# EAGLE design Noduino-Quantum (EAGLE 6.6.0)
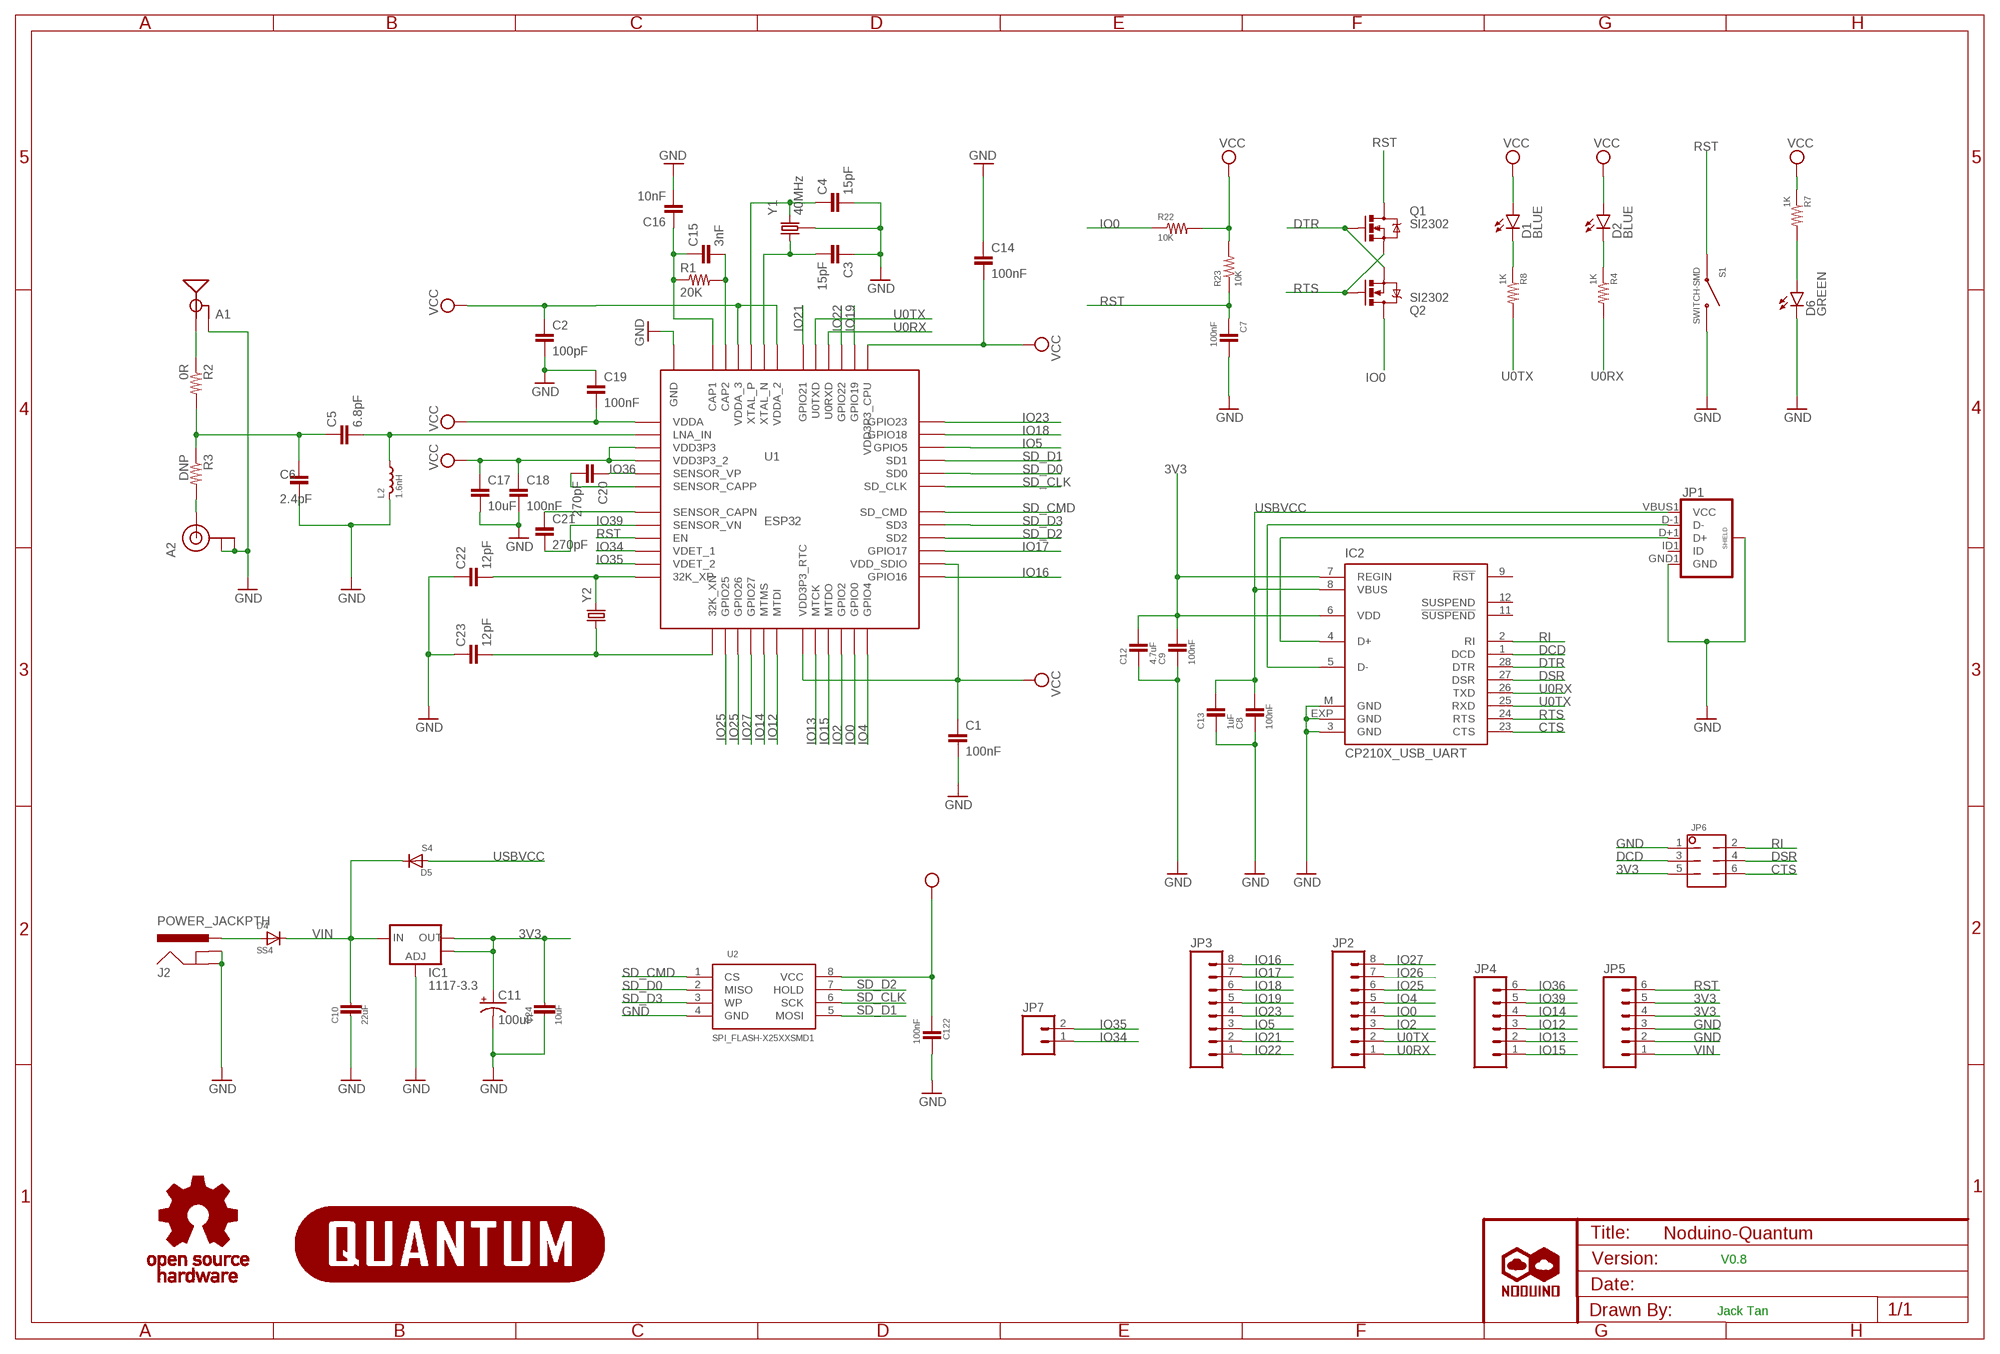
[diagram p0: schematic, sheet 1]

## Parts
A1  ANTENNATPLACE  [TRACE_ANTENNA_2.4GHZ_15.2MM_TPLACE]
A2  U.FL  [U.FL]
C1  100nF  0402-CAP  [0402-CAP]
C2  100pF  0402-CAP  [0402-CAP]
C3  15pF  0402-CAP  [0402-CAP]
C4  15pF  0402-CAP  [0402-CAP]
C5  6.8pF  0402-CAP  [0402-CAP]
C6  2.4pF  0402-CAP  [0402-CAP]
C7  100nF  0402-CAP  [0402-CAP]
C8  100nF  0603-CAP  [0603-CAP]
C9  100nF  0603-CAP  [0603-CAP]
C10  22uF  CAP-C1206  [C1206]
C11  100uF  CAP_POL3528  [EIA3528]
C12  4.7uF  0603-CAP  [0603-CAP]
C13  1uF  0603-CAP  [0603-CAP]
C14  100nF  0402-CAP  [0402-CAP]
C15  3nF  0402-CAP  [0402-CAP]
C16  10nF  0402-CAP  [0402-CAP]
C17  10uF  0603-CAP  [0603-CAP]
C18  100nF  0402-CAP  [0402-CAP]
C19  100nF  0402-CAP  [0402-CAP]
C20  270pF  0402-CAP  [0402-CAP]
C21  270pF  0402-CAP  [0402-CAP]
C22  12pF  0402-CAP  [0402-CAP]
C23  12pF  0402-CAP  [0402-CAP]
C24  10uF  CAP-C1206  [C1206]
C122  100nF  0402-CAP  [0402-CAP]
D1  BLUE  LED-GREEN0603  [LED-0603]
D2  BLUE  LED-GREEN0603  [LED-0603]
D4  SS4  DIODEHV  [DO214]
D5  S4  DIODESOD  [SOD-323]
D6  GREEN  LED-GREEN0603  [LED-0603]
IC1  1117-3.3  AMS1117SOT223  [SOT223]
IC2  CP210X_USB_UART  [MLP28]
J2  POWER_JACKPTH  [POWER_JACK_PTH]
JP1  USB_MICROB_PLUG  [MICROUSB-SMD-DIP]
JP2  M081X08  [1X08]
JP3  M081X08  [1X08]
JP4  M06SIP  [1X06]
JP5  M06SIP  [1X06]
JP6  M02X3  [2X3]
JP7  M02PTH  [1X02]
L2  1.6nH  INDUCTOR0402  [0402-IND]
Q1  SI2302  -MOSFET-N-SMD  [SOT23-3]
Q2  SI2302  -MOSFET-N-SMD  [SOT23-3]
R1  20K  0402-RESISTOR  [0402-RES]
R2  0R  0402-RESISTOR  [0402-RES]
R3  DNP  0402-RESISTOR  [0402-RES]
R4  1K  0603-RESISTOR  [0603-RES]
R7  1K  0603-RESISTOR  [0603-RES]
R8  1K  0603-RESISTOR  [0603-RES]
R22  10K  0603-RESISTOR  [0603-RES]
R23  10K  0402-RESISTOR  [0402-RES]
S1  SWITCH-SMD  [TACTILE-SWITCH-1101NE]
U1  ESP32  [QFN48-0.4MM]
U2  SPI_FLASH-X25XXSMD1  [SO08-EIAJ]
U$1  NODUINO-LOGO-ALL  [NODUINO-ALL-1]
U$2  NODUINO-QUANTUM-LOGO  [NODUINO-QUANTUM-LOGO]
U$3  OPEN_HARDWARE_LOGO  [OPEN_HARDWARE_LOGO]
Y1  40MHz  CRYSTAL-GROUNDED2520  [2520-CRY]
Y2  CRYSTALMS3V  [CRYSTAL-32KHZ-MS3V]

## Nets
3V3: C1.1 C2.1 C9.2 C11.A(+) C12.2 C14.2 C17.1 C18.1 C19.2 C24.1 C122.1 D1.A D2.A IC1.2(OUT) IC1.4(OUT) IC2.6(VDD) IC2.7(REGIN) JP5.4 JP5.5 JP6.5 R7.1 R22.2 R23.2 U1.1(VDDA) U1.3(VDD3P3) U1.4(VDD3P3_2) U1.19(VDD3P3_RTC) U1.26(VDD_SDIO) U1.37(VDD3P3_CPU) U1.43(VDDA_2) U1.46(VDDA_3) U2.8(VCC) ; supply symbol labelled VCC
CTS: IC2.23(CTS) JP6.6
DCD: IC2.1(DCD) JP6.3
DSR: IC2.27(DSR) JP6.4
DTR: IC2.28(DTR) Q1.1(G) Q2.2(S)
GND: A1.GND A2.P$1(GND) A2.P$2(GND) C1.2 C2.2 C3.1 C4.2 C6.2 C7.2 C8.1 C9.1 C10.2 C11.C(-) C12.1 C13.1 C14.1 C16.2 C17.2 C18.2 C19.1 C22.1 C23.1 C24.2 C122.2 D6.C IC1.1(ADJ) IC2.3(GND) IC2.EXP(GND) IC2.M(GND) J2.GND J2.GNDBREAK JP1.GND1(GND) JP1.P$1(SHIELD) JP1.P$2(SHIELD) JP1.P$3(SHIELD) JP1.P$4(SHIELD) JP5.2 JP5.3 JP6.1 L2.1(X1) S1.P$1 U1.EP(GND) U2.4(GND) Y1.2(GND) Y1.4(GND)
IO0: JP2.4 Q2.3(D) R22.1 U1.23(GPIO0)
IO2: JP2.3 U1.22(GPIO2)
IO4: JP2.5 U1.24(GPIO4)
IO5: JP3.3 U1.34(GPIO5)
IO12: JP4.3 U1.18(MTDI)
IO13: JP4.2 U1.20(MTCK)
IO14: JP4.4 U1.17(MTMS)
IO15: JP4.1 U1.21(MTDO)
IO16: JP3.8 U1.25(GPIO16)
IO17: JP3.7 U1.27(GPIO17)
IO18: JP3.6 U1.35(GPIO18)
IO19: JP3.5 U1.38(GPIO19)
IO21: JP3.2 U1.42(GPIO21)
IO22: JP3.1 U1.39(GPIO22)
IO23: JP3.4 U1.36(GPIO23)
IO25: JP2.6 U1.14(GPIO25)
IO26: JP2.7 U1.15(GPIO26)
IO27: JP2.8 U1.16(GPIO27)
IO34: JP7.1 U1.10(VDET_1)
IO35: JP7.2 U1.11(VDET_2)
IO36: C20.1 JP4.6 U1.5(SENSOR_VP)
IO39: C21.2 JP4.5 U1.8(SENSOR_VN)
LNA: C5.2 L2.2(X2) U1.2(LNA_IN)
N$1: D1.C R8.1
N$2: C4.1 U1.45(XTAL_P) Y1.3
N$3: C3.2 U1.44(XTAL_N) Y1.1
N$5: IC2.4(D+) JP1.D+1(D+)
N$7: A1.ANT(SIGNAL) R2.1
N$9: IC2.5(D-) JP1.D-1(D-)
N$11: C15.2 R1.2 U1.47(CAP2)
N$12: D2.C R4.1
N$13: D6.A R7.2
N$16: D4.A J2.PWR
N$17: C15.1 C16.1 R1.1 U1.48(CAP1)
N$18: A2.P$3(SIGNAL) R3.2
N$20: C5.1 C6.1 R3.1
N$24: C21.1 U1.7(SENSOR_CAPN)
N$26: C20.2 U1.6(SENSOR_CAPP)
N$30: C22.2 U1.12(32K_XP) Y2.P$2
N$31: C23.2 U1.13(32K_XN) Y2.P$1
RI: IC2.2(RI) JP6.2
RST: C7.1 JP5.6 Q1.3(D) R23.1 S1.P$2 U1.9(EN)
RTS: IC2.24(RTS) Q1.2(S) Q2.1(G)
SD_CLK: U1.31(SD_CLK) U2.6(SCK)
SD_CMD: U1.30(SD_CMD) U2.1(CS)
SD_D0: U1.32(SD0) U2.2(MISO)
SD_D1: U1.33(SD1) U2.5(MOSI)
SD_D2: U1.28(SD2) U2.7(HOLD)
SD_D3: U1.29(SD3) U2.3(WP)
U0RX: IC2.26(TXD) JP2.1 R4.2 U1.40(U0RXD)
U0TX: IC2.25(RXD) JP2.2 R8.2 U1.41(U0TXD)
USBVCC: C8.2 C13.2 D5.2(A) IC2.8(VBUS) JP1.VBUS1(VCC)
VIN: C10.1 D4.C D5.1(C) IC1.3(IN) JP5.1
Unconnected: IC2.9(!RST) IC2.11(!SUSPEND) IC2.12(SUSPEND) JP1.ID1(ID) R2.2

## Notes on the sheet
- V0.8
- Jack Tan

## Library data of the parts
A1 = ehl:ANTENNA: Chip antenna Chip antenna with ground or secondary connection. Common with larger metal RF connectors.
A2 = SparkFun_ESP8266_Thing:U.FL: SMD antenna connector- WRL-09144; PROD_ID: CONN-09193
C1-C7 C14-C16 C18-C23 C122 = ehl:0402-CAP
C8 C9 C12 C13 C17 = ehl:0603-CAP
C10 C24 = digital-toy:CAP: Capacitor Standard 0603 ceramic capacitor, and 0.1" leaded capacitor.
C11 = ehl:CAP_POL: Capacitor Polarized These are standard SMD and PTH capacitors. Normally 10uF, 47uF, and 100uF in electrolytic and tantalum varieties. Always verify the external diameter of the through hole cap, it varies with capacity, voltage, and manufacturer. The EIA devices should be standard.
D1 D2 = SparkFun_ESP8266_Thing:LED-GREEN: Various green LEDs Green LEDs used in SFE Production 0603- DIO-00821 LARGE- DIO-00862 LILYPAD- DIO-09910; PROD_ID: DIO-00821; VALUE: GREEN
D4 D5 = ehl:DIODE: Diode These are standard reverse protection diodes and small signal diodes. SMA package can handle up to about 1A. SOD-323 can handle about 200mA. What the SOD-323 package when ordering, there are some mfgs out there that are 5-pin packages.
D6 = SparkFun_ESP8266_Thing:LED-GREEN: Various green LEDs Green LEDs used in SFE Production 0603- DIO-00821 LARGE- DIO-00862 LILYPAD- DIO-09910; PROD_ID: DIO-00821
IC1 = ehl:AMS1117: Voltage Regulator LM1117 Standard adjustable voltage regulator but in SMD form. Spark Fun Electronics SKU : COM-00595
IC2 = ehl:CP210X_USB_UART: Single-Chip USB to UART Bridge Source: www.silabs.com .. CP2101.pdf / cp2102.pdf. Spark Fun Electronics SKU : COM-00310
J2 = ehl:POWER_JACK: Power Jack This is the standard 5.5mm barrel jack for power. The PTH is the most common, proven, reliable, footprint. All others are experimental. The Slot footprint only works if the mill layer is transmitted to the PCB fab house so be warned. Spark Fun Electronics SKU : PRT-00119. Mating wall wart : TOL-00298 (and others)
JP1 = ehl:USB_MICROB_PLUG: USB Micro-B connectors Some male, some female. Watch your step!
JP2 JP3 = ehl:M08: Header 8 Standard 8-pin 0.1" header. Use with straight break away headers (SKU : PRT-00116), right angle break away headers (PRT-00553), swiss pins (PRT-00743), machine pins (PRT-00117), and female headers (PRT-00115).
JP4 JP5 = ehl:M06: Header 6 Standard 6-pin 0.1" header. Use with straight break away headers (SKU : PRT-00116), right angle break away headers (PRT-00553), swiss pins (PRT-00743), machine pins (PRT-00117), and female headers (PRT-00115). Molex polarized connector foot print use with SKU : PRT-08094 with associated crimp pins and housings. NOTES ON THE VARIANTS LOCK and LOCK_LONGPADS... This footprint was designed to help hold the alignment of a through-hole component (i.e. 6-pin header) while soldering it into place. You may notice that each hole has been shifted either up or down by 0.005 of an inch from it's more standard position (which is a perfectly straight line). This slight alteration caused the pins (the squares in the middle) to touch the edges of the holes. Because they are alternating, it causes a "brace" to hold the component in place. 0.005 has proven to be the perfect amount of "off-center" position when using our standard breakaway headers. Although looks a little odd when you look at the bare footprint, once you have a header in there, the alteration is very hard to notice. Also, if you push a header all the way into place, it is covered up entirely on the bottom side. This idea of altering the position of holes to aid alignment will be further integrated into the Sparkfun Library for other footprints. It can help hold any component with 3 or more connection pins.
JP6 = ehl:M02X3
JP7 = ehl:M02: Header 2 Standard 2-pin 0.1" header. Use with straight break away headers (SKU : PRT-00116), right angle break away headers (PRT-00553), swiss pins (PRT-00743), machine pins (PRT-00117), and female headers (PRT-00115). Molex polarized connector foot print use with SKU : PRT-08233 with associated crimp pins and housings.
L2 = ehl:INDUCTOR
Q1 Q2 = digital-toy:*-MOSFET-N
R1-R3 R23 = ehl:0402-RESISTOR
R4 R7 R8 R22 = ehl:0603-RESISTOR
S1 = ehl:SWITCH-SMD
U1 = ehl:ESP32
U2 = ehl:SPI_FLASH-X25XX: 8pin SPI Flash series x25xx. Works with devices like W25X32 and BR25L32
U$1 = ehl:NODUINO-LOGO-ALL
U$2 = ehl:NODUINO-QUANTUM-LOGO
U$3 = ehl:OPEN_HARDWARE_LOGO
Y1 = ehl:CRYSTAL-GROUNDED
Y2 = ehl:CRYSTAL: Crystals Various standard crystals. Proven footprints. Spark Fun Electronics SKU : COM-00534

## Board
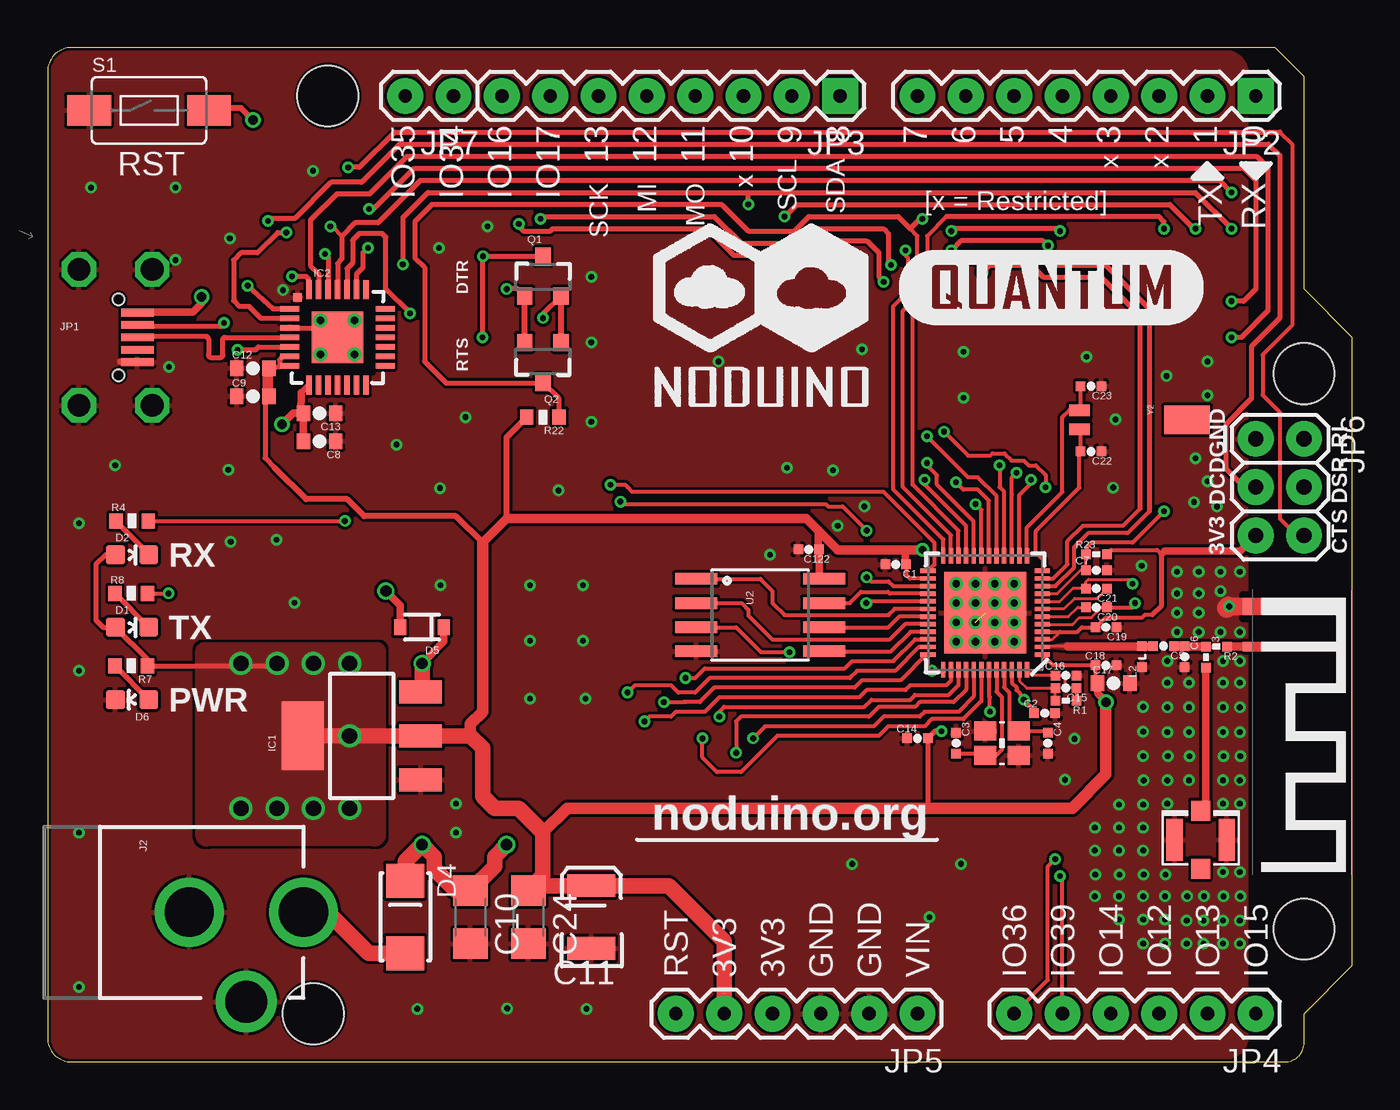
[diagram p1: board, top side]
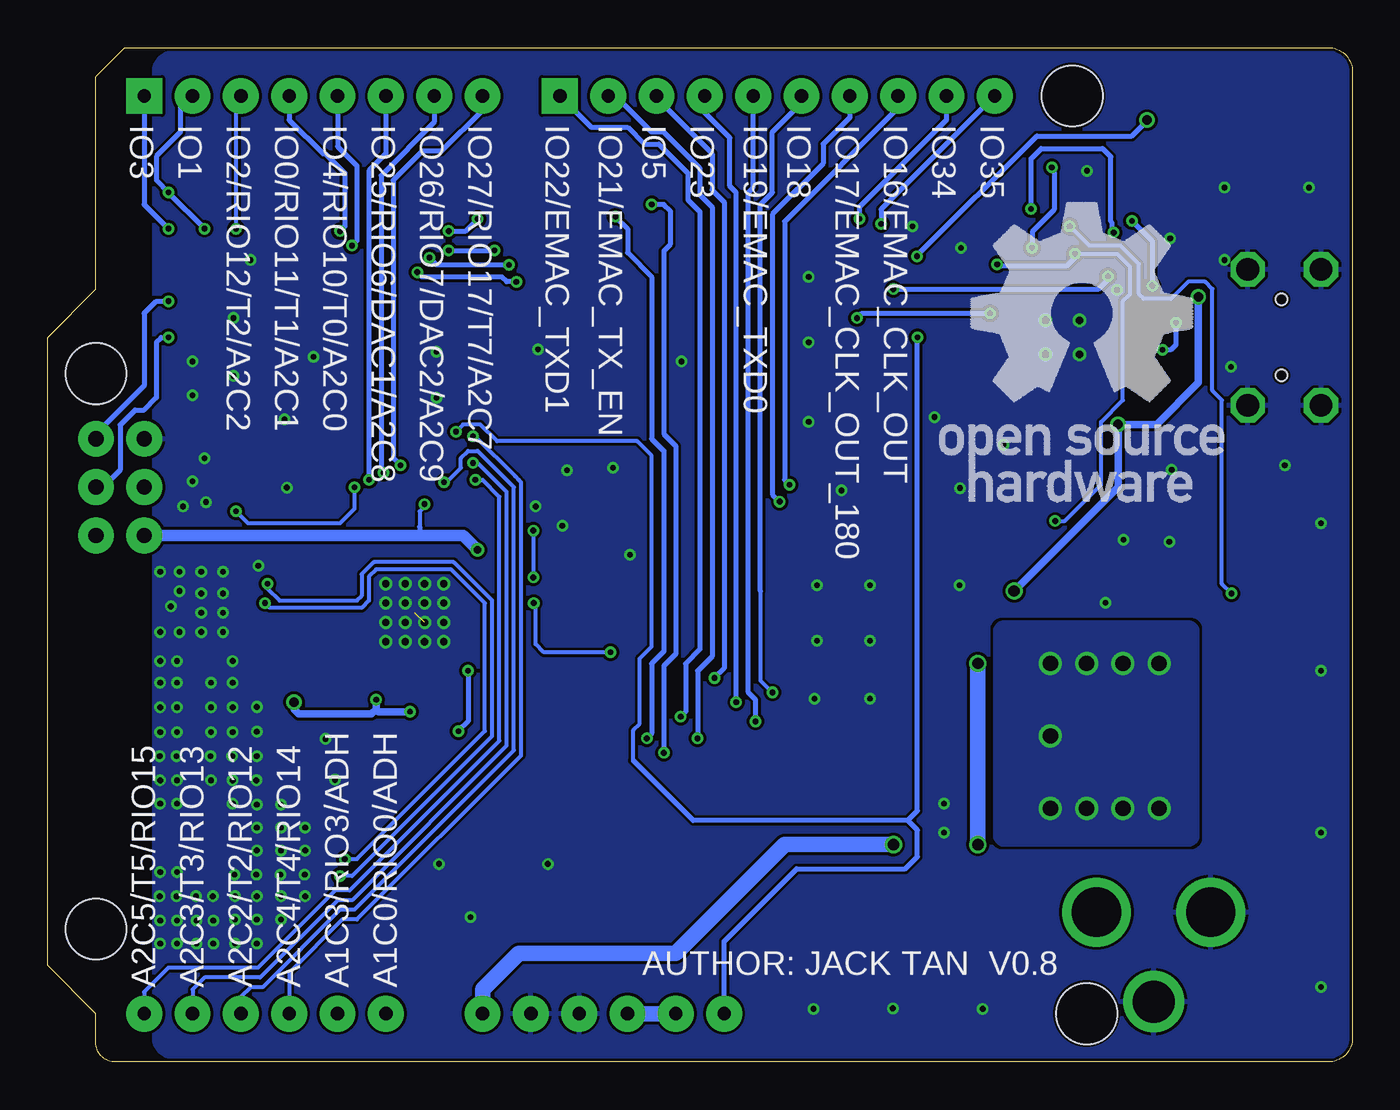
[diagram p2: board, bottom side, seen from below]

Size 68.58 x 53.34 mm. Coordinates in mm from the lower left corner, seen from the top.
Outline: 1.27,0 65.02,0 arc90 66.04,1.02 66.04,2.54 68.58,5.08 68.58,38.1 66.04,40.64 66.04,51.82 64.52,53.34 1.27,53.34 arc90 0,52.07 0,1.27 arc90 1.27,0
Copper layers (1*16): Top 0.035mm / dielectric 1.5mm / Bottom 0.035mm
Design rules "jackslab-micromod": minimum track width 6mil, minimum drill 0.3mm, track to track 6mil, track to pad 6mil, pad to pad 6mil, via to via 6mil, smd to smd 6mil, copper to edge 6mil, drill to drill 6mil, minimum pad ring 6mil, minimum via ring 6mil, stop-mask expansion 4mil, vias tented up to drill 20mil, thermal gap 6mil
Holes 3.2 mm at 66.04,6.99 66.04,36.2 14.73,50.8 13.97,2.54

### Footprints (pad centres in the part's own frame; a part is rotated, then mirrored left to right if it is on the bottom)
TRACE_ANTENNA_2.4GHZ_15.2MM_TPLACE = smd 0.5 x 0.5: ANT 0,-0.25 | smd 0.9 x 0.5: GND -2.1,-0.25
U.FL = smd 2.2 x 0.85: P$1 0,1.375; P$2 0,-1.375 | smd 1.05 x 1: P$3 1.525,0; P$4 -1.525,0
0402-CAP = smd 0.5 x 0.5: 1 -0.55,0; 2 0.55,0
0603-CAP = smd 0.7 x 0.8: 1 -0.85,0; 2 0.85,0
C1206 = smd 1.6 x 1.8: 1 -1.4,0; 2 1.4,0
EIA3528 = smd 1.2 x 2.5: A 1.65,0; C -1.65,0
LED-0603 = smd 1 x 1: A 0,-0.877; C 0,0.877
DO214 = smd 1.8 x 2: A 1.9,0; C -1.9,0
SOD-323 = smd 0.63 x 0.83: 1 -1.15,0; 2 1.15,0
SOT223 = smd 1.219 x 2.235: 1 -2.311,-3.099; 2 0,-3.099; 3 2.311,-3.099 | smd 3.6 x 2.2: 4 0,3.099
MLP28 = smd 1 x 0.3: 1 -2.5,1.5; 2 -2.5,1; 3 -2.5,0.5; 4 -2.5,0; 5 -2.5,-0.5; 6 -2.5,-1; 7 -2.5,-1.5; 15 2.5,-1.5; 16 2.5,-1; 17 2.5,-0.5; 18 2.5,0; 19 2.5,0.5; 20 2.5,1; 21 2.5,1.5 | smd 0.3 x 1: 8 -1.5,-2.5; 9 -1,-2.5; 10 -0.5,-2.5; 11 0,-2.5; 12 0.5,-2.5; 13 1,-2.5; 14 1.5,-2.5; 22 1.5,2.5; 23 1,2.5; 24 0.5,2.5; 25 0,2.5; 26 -0.5,2.5; 27 -1,2.5; 28 -1.5,2.5 | smd 2.7 x 2.7: EXP 0,0 | smd 0.435 x 0.435: M -2.103,2.103
POWER_JACK_PTH = drill 2.6: GND 0,7.7; PWR 0,13.7 | drill 2.2: GNDBREAK 4.7,10.7
MICROUSB-SMD-DIP = smd 1.7 x 0.4: D+1 3.2,0; D-1 3.2,0.65; GND1 3.2,-1.3; ID1 3.2,-0.65; VBUS1 3.2,1.3 | drill 1.2 octagon: P$1 0.125,-3.575; P$2 0.125,3.575; P$3 3.975,-3.575; P$4 3.975,3.575 | hole 0.6: 2.2,2; 2.2,-2
1X08 = drill 0.7 pad 1.88 square: 1 0,0 | drill 0.7 pad 1.88: 2 2.54,0; 3 5.08,0; 4 7.62,0; 5 10.16,0; 6 12.7,0; 7 15.24,0; 8 17.78,0
1X06 = drill 0.7 pad 1.88: 1 0,0; 2 2.54,0; 3 5.08,0; 4 7.62,0; 5 10.16,0; 6 12.7,0
2X3 = drill 0.8 pad 1.88: 1 0,0; 2 0,2.54; 3 2.54,0; 4 2.54,2.54; 5 5.08,0; 6 5.08,2.54
1X02 = drill 0.7 pad 1.88: 1 0,0; 2 2.54,0
0402-IND = smd 0.5 x 0.5: 1 -0.55,0; 2 0.55,0
SOT23-3 = smd 0.8 x 0.9: 1 -0.95,-1; 2 0.95,-1; 3 0,1.1
0402-RES = smd 0.5 x 0.5: 1 -0.55,0; 2 0.55,0
0603-RES = smd 0.7 x 0.8: 1 -0.85,0; 2 0.85,0
TACTILE-SWITCH-1101NE = smd 2.3 x 1.6: P$1 -3.15,0; P$2 3.15,0
QFN48-0.4MM = smd 0.8 x 0.23: 1 -3,2.2; 2 -3,1.8; 3 -3,1.4; 4 -3,1; 5 -3,0.6; 6 -3,0.2; 7 -3,-0.2; 8 -3,-0.6; 9 -3,-1; 10 -3,-1.4; 11 -3,-1.8; 12 -3,-2.2; 25 3,-2.2; 26 3,-1.8; 27 3,-1.4; 28 3,-1; 29 3,-0.6; 30 3,-0.2; 31 3,0.2; 32 3,0.6; 33 3,1; 34 3,1.4; 35 3,1.8; 36 3,2.2 | smd 0.23 x 0.8: 13 -2.2,-3; 14 -1.8,-3; 15 -1.4,-3; 16 -1,-3; 17 -0.6,-3; 18 -0.2,-3; 19 0.2,-3; 20 0.6,-3; 21 1,-3; 22 1.4,-3; 23 1.8,-3; 24 2.2,-3; 37 2.2,3; 38 1.8,3; 39 1.4,3; 40 1,3; 41 0.6,3; 42 0.2,3; 43 -0.2,3; 44 -0.6,3; 45 -1,3; 46 -1.4,3; 47 -1.8,3; 48 -2.2,3 | smd 4.3 x 4.3: EP 0,0
SO08-EIAJ = smd 0.61 x 2.21: 1 -1.905,-3.378; 2 -0.635,-3.378; 3 0.635,-3.378; 4 1.905,-3.378; 5 1.905,3.353; 6 0.635,3.353; 7 -0.635,3.353; 8 -1.905,3.353
2520-CRY = smd 1.15 x 1: 1 -0.875,-0.65; 2 0.875,-0.65; 3 0.875,0.65; 4 -0.875,0.65
CRYSTAL-32KHZ-MS3V = smd 0.6 x 1.1: P$1 -0.5,-2; P$2 0.5,-2 | smd 1.5 x 2.4: P$3 0,3.65

### Placement (x,y rotation side)
A1  63.32,21.84 270 top
A2  60.6,11.68 90 top
C1  44.58,26.16 180 top
C2  52.4,18.34 0 top
C3  47.75,16.76 270 top
C4  52.58,16.76 270 top
C5  58.65,21.87 180 top
C6  59.77,21.31 270 top
C7  55.12,25.86 0 top
C8  14.3,32.64 180 top
C9  10.79,35 0 top
C10  22.23,7.62 270 top
C11  28.57,7.62 90 top
C12  10.79,36.47 0 top
C13  14.3,34.11 180 top
C14  45.72,17.02 0 top
C15  53.52,19.66 180 top
C16  53.52,20.32 0 top
C17  56.03,19.91 0 top
C18  55.63,20.85 0 top
C19  55.63,22.86 180 top
C20  55.12,23.9 180 top
C21  55.12,24.89 180 top
C22  54.84,32.11 180 top
C23  54.84,35.53 180 top
C24  25.27,7.62 270 top
C122  40.01,26.95 180 top
D1  4.45,22.86 270 top
D2  4.45,26.67 270 top
D4  18.8,7.62 270 top
D5  19.68,22.86 180 top
D6  4.45,19.05 90 top
IC1  16.51,17.14 90 top
IC2  15.24,38.1 0 top
J2  -0.25,7.87 270 top
JP1  1.52,38.1 0 top
JP2  63.5,50.8 180 top
JP3  41.66,50.8 180 top
JP4  63.5,2.54 180 top
JP5  45.72,2.54 180 top
JP6  63.5,32.77 270 top
JP7  21.34,50.8 180 top
L2  57.53,21.31 90 top
Q1  26.04,41.27 0 top
Q2  26.04,36.83 180 top
R1  53.52,19 180 top
R2  61.44,21.84 180 top
R3  60.88,21.29 270 top
R4  4.45,28.45 0 top
R7  4.39,20.83 180 top
R8  4.39,24.64 0 top
R22  26.04,33.91 180 top
R23  55.12,26.7 0 top
S1  5.33,50.04 0 top
U1  49.28,23.62 180 top
U2  37.47,23.5 270 top
U$1  31.5,33.78 0 top
U$2  44.76,38.77 0 top
U$3  21.71,29.44 0 bottom
Y1  50.16,16.76 0 top
Y2  56.24,33.76 270 top

### Tracks (layer width: path | path; a pad name or v marks a point on that pad's centre or on a via)
3V3  (via drill 0.3, 0.4, 0.5, 0.81)
  Top 0.152: U1.3 52.81,22.22 53.21,22.62
  Top 0.203: U1.43 49.48,19.23 49.53,19.18 v49.53,18.41 | U1.46 50.68,19.94 50.93,19.68 50.93,19.56 51.31,19.18 v51.31,19.05 51.85,18.51 C2.1 | U1.37 47.08,20.53 | U1.1 52.84,20.85 C18.1 55.08,20 55.16,19.91 C17.1 | U1.19 49.08,29.03 v48.77,29.34 | 58.06,23.52 57.68,23.52 57.53,23.37 55.63,23.37 55.08,22.82 C19.2 54.36,22.86 54.12,22.62 53.21,22.62 U1.4 | 58.55,26.7 58.32,26.92 55.9,26.92 R23.2 | U1.26 45.32,25.42 45.13,25.61 C1.1
  Top 0.254: 12.19,36.6 IC2.7 | IC2.6 12.37,37.11 12.19,36.93 12.19,36.6 | C9.2 11.43,35.48 | 11.43,35.48 11.43,36.2 | C12.2 12.19,36.58 12.19,36.6 | 58.06,23.52 58.55,24 58.55,26.7 | 11.43,35.48 11.43,31.75 11.94,31.24 | v12.06,20.95 11.94,20.83 R7.1 5.24,21.18 D1.A 2.92,22.86 2.54,23.24 2.54,26.16 3.05,26.67 D2.A | 47.08,20.53 46.52,20.53 v46.48,20.57 | 46.23,13.34 46.27,13.38 C14.2 46.65,17.4 v46.99,17.4
  Top 0.305: IC1.4 13.41,17.22 13.97,17.78 13.34,17.78 13.34,18.41 | 58.55,26.7 58.73,26.87 | 22.86,27.3 21.46,28.7 16.64,28.7 15.75,29.59 13.59,29.59 11.94,31.24 | 24.13,28.57 24.13,32.85 R22.2
  Top 0.406: JP6.5 62.69,26.87 58.73,26.87 | C9.2 C12.2 | C17.1 55.18,19.37 v55.63,18.92 | 40.51,26.99 C122.1 40.55,26.42 | 40.55,26.42 40.55,25.66 U2.8 | 40.51,27.94 40.51,26.46 40.55,26.42 | 45.09,26.92 45.09,26.2 C1.1
  Top 0.508: 22.86,27.3 24.13,28.57 39.88,28.57 40.51,27.94 41.53,26.92 45.09,26.92 v45.97,26.92
  Top 0.61: 26.04,12.06 27.3,13.34 46.23,13.34 53.85,13.34 55.63,15.11 v55.63,18.92 | 22.23,17.14 22.23,17.78 22.86,18.41 22.86,27.3
  Top 0.813: JP5.5 35.56,6.35 32.64,9.27 C11.A 25.52,9.27 C24.1 26.04,9.78 26.04,12.06 24.77,13.34 23.5,13.34 22.86,13.97 22.86,16.51 22.23,17.14 IC1.2 IC1.4
  Bottom 0.203: v48.77,29.34 48.77,29.21 49.02,28.96 49.02,28.14
  Bottom 0.254: 49.02,28.14 49.02,27.69 | v46.48,20.57 46.48,17.91 v46.99,17.4
  Bottom 0.406: v55.63,18.92 55.63,18.54 55.37,18.29 51.56,18.29 51.31,18.54 | 51.31,18.54 v51.31,19.05 | v49.53,18.41 51.18,18.41 51.31,18.54
  Bottom 0.61: JP6.5 49.02,27.69 46.74,27.69 v45.97,26.92
  Bottom 0.813: JP5.5 JP5.4
  other vias: 13.97,20.95 15.88,20.95 10.16,13.34 12.06,13.34 13.97,13.34 15.88,13.34 15.88,17.14 10.16,20.95
  pour Bottom (no thermals): 8.13,12.7 8.13,22.61 arc-90 8.64,23.11 17.53,23.11 18.03,23.11 18.29,23.11 arc-90 18.8,22.61 18.8,18.29 18.8,12.19 18.8,11.94 arc-90 18.29,11.43 8.64,11.43 arc-90 8.13,11.94
  pour Top (no thermals): 7.87,12.7 7.87,21.59 arc-90 8.26,21.97 17.14,21.97 17.3,21.97 arc-90 17.68,21.59 17.68,18.82 17.68,15.39 17.68,14.43 17.68,12.83 17.68,11.96 arc-90 17.14,11.43 8.38,11.43 arc-90 7.87,11.94
CTS  (via drill 0.3)
  Top 0.203: 64.77,48.9 65.41,48.26 65.41,38.73 63.86,37.19 63.86,35.08 64.77,34.16 64.77,28.57 65.66,27.69
  Top 0.254: 64.77,48.9 18.24,48.9 16.38,47.04 v15.8,47.04 | 65.66,27.69 JP6.6 | IC2.23 16.26,40.62 16.26,41.45 16.59,41.78 16.59,42.57 16.82,42.8 v16.84,42.8
  Bottom 0.254: v16.84,42.8 16.79,42.85 16.79,43.69 15.67,44.81 15.67,46.79 v15.8,47.04
DCD  (via drill 0.3)
  Top 0.254: JP6.3 62.89,30.23 61.92,31.19 61.92,33.53 63.27,34.87 63.27,37.62 64.77,39.12 64.77,47.68 64.16,48.26 18.52,48.26 16.51,46.25 14.88,46.25 13.01,44.37 11.71,44.37 11.58,44.25 v11.58,44.22 | v10.52,40.82 11.86,39.6 IC2.1
  Bottom 0.254: v11.58,44.22 10.52,43.16 v10.52,40.82
DSR  (via drill 0.3)
  Top 0.254: v62.23,38.1 62.74,38.1 64.14,39.5 64.14,47.04 63.55,47.62 18.9,47.62 16.92,45.64 15.19,45.64 13.82,44.27 13.82,41.88 14.24,41.46 IC2.27
  Bottom 0.254: JP6.4 65.66,30.23 64.77,31.11 64.77,33.5 63.98,34.29 63.5,34.29 62.87,34.92 62.87,37.85 62.61,38.1 v62.23,38.1
DTR  (via drill 0.3)
  Top 0.254: Q1.1 25.07,40.26 24.66,40.66 24.16,40.66 v24.13,40.64 | IC2.28 13.72,40.62 13.72,41.17 13.59,41.3 v12.85,41.3
  Top 0.305: Q2.2 Q1.1
  Bottom 0.254: v24.13,40.64 13.34,40.64 12.85,41.12 v12.85,41.3
GND  (via drill 0.3, 0.38, 0.4)  (1 unrouted)
  Top 0.254: 14.25,38.58 12.76,38.58 IC2.3
  Top 0.305: 3.81,36.83 3.84,36.8 JP1.GND1 | 14.25,38.58 14.73,38.1 IC2.EXP
  Top 0.914: A1.GND 62.04,23.94
  Top 1.016: 62.04,23.94 61.98,23.88
  other vias: 57.91,42.16 58.8,39.12 58.8,36.07 62.66,21.08 62.66,19.94 62.66,18.64 62.66,17.35 62.69,16.08 61.47,29.21 60.33,31.75 60.96,35.05 60.96,36.83 6.73,42.16 3.56,31.37 6.38,36.55 13.94,46.86 21.97,33.91 28.32,2.79 1.65,20.57 12.04,27.46 9.63,27.36 12.98,24.16 20.65,25.07 20.62,30.18 42.29,10.41 48.01,10.41 42.93,29.21 19.43,2.79 60.25,29.44 60.96,30.53 62.66,14.81 62.66,13.59 62.1,23.95 9.58,43.31 2.29,45.97 6.73,45.97 24.16,2.82 35.26,36.83 46.35,7.62 48.77,25.15 47.75,25.15 47.75,24.13 47.75,23.11 47.75,22.1 48.77,22.1 50.8,25.15 49.78,25.15 12.37,40.59 14.35,37.21 16.13,37.21 16.13,38.99 14.35,38.99 48.13,37.34 56.13,33.78 41.27,31.11 37.97,26.67 57.51,26.09 53.98,16.99 56.01,30.2 41.53,28.19 48.77,24.13 49.78,24.13 50.8,24.13 50.8,23.11 49.78,23.11 48.77,23.11 49.78,22.1 50.8,22.1 62.66,22.61 61.65,22.61 60.5,22.61 59.36,22.61 60.5,23.62 60.5,24.64 60.5,25.78 62.66,25.78 61.65,25.78 59.36,25.78 58.85,21.08 58.85,19.94 58.85,18.64 58.85,17.35 58.88,16.08 58.85,14.81 61.77,21.08 61.77,19.94 61.77,18.64 61.77,17.35 61.8,16.08 61.77,14.81 61.77,13.59 58.85,13.59 59.99,19.94 59.99,18.64 59.99,17.35 60.02,16.08 59.99,14.81 57.58,18.67 57.58,17.37 57.58,16.08 57.61,14.81 57.58,13.54 57.58,12.32 60.78,8.71 60.76,7.44 60.76,6.22 59.89,8.71 59.87,7.44 59.87,6.22 62.66,9.98 62.69,8.71 62.66,7.44 62.66,6.22 61.77,9.98 61.8,8.71 61.77,7.44 61.77,6.22 57.58,11.13 57.61,9.86 57.58,8.71 57.58,7.49 57.58,6.22 58.72,8.71 58.72,7.49 58.72,6.22 58.75,9.86 56.31,13.54 56.31,12.32 56.31,11.13 56.34,9.86 56.31,8.71 56.31,7.49 59.36,24.64 59.36,23.62 61.65,24.77 53.47,14.83 55.04,12.32 55.04,11.13 55.07,9.86 55.04,8.71 25.35,25.07 28.14,25.07 28.14,22.15 25.35,22.15 9.5,31.14 18.34,32.46 28.27,19.1 25.35,19.1 26.85,30.05 20.57,42.8 23.11,43.94 28.57,41.27 28.57,37.85 28.57,33.66 38.86,31.24 42.8,37.47 48.13,34.92 54.61,37.08 1.65,12.06 1.65,3.94 1.65,28.32 21.46,12.06 21.46,13.59
  pour Top (isolate 0.152, rank 2): 0.25,51.82 0.25,52.07 arc-90 1.27,53.09 61.98,53.09 arc-90 62.99,52.07 62.99,1.27 arc-90 61.98,0.25 1.27,0.25 arc-90 0.25,1.27
  pour Top (isolate 0.152, rank 2): 0.25,44.7 0.25,52.07 arc-90 1.27,53.09 61.98,53.09 arc-90 62.99,52.07 62.99,1.27 arc-90 61.98,0.25 1.27,0.25 arc-90 0.25,1.27
  pour Bottom (isolate 0.152, rank 2): 61.98,53.09 arc-90 62.99,52.07 62.99,1.27 arc-90 61.98,0.25 1.27,0.25 arc-90 0.25,1.27 0.25,52.58 arc-90 1.02,53.09
IO0  (via drill 0.3)
  Top 0.203: 45.34,43.81 45.72,43.43 45.72,40.26 44.96,39.5 44.96,30.23 47.48,27.71 U1.23
  Top 0.254: R22.1 26.89,34.88 Q2.3 25.99,35.69 20.95,35.69 19.81,36.83 19.81,41.78 19.3,42.29 19.3,44.2 20.19,45.09 35.43,45.09 36.83,43.69 39.24,43.69 40.01,44.45 44.7,44.45 45.34,43.81 45.85,44.32 v45.97,44.32 | v53.21,43.69 53.09,43.81 47.62,43.81 v47.5,43.69
  Bottom 0.254: JP2.4 55.88,49.53 54.1,47.75 53.98,47.75 52.96,46.74 52.96,43.94 v53.21,43.69 | v47.5,43.69 46.61,43.69 v45.97,44.32
IO2  (via drill 0.3)
  Top 0.203: U1.22 47.88,27.94 45.47,30.35 45.47,39.24 46.23,40.01 46.23,43.43 47.24,44.45
  Top 0.254: v58.67,43.81 58.67,44.2 58.42,44.45 47.24,44.45
  Bottom 0.203: v58.67,43.81 58.67,50.55 JP2.3
IO4  (via drill 0.3)
  Top 0.203: U1.24 47.08,27.47 44.45,30.1 44.45,39.75 45.21,40.51 45.21,42.29 45.09,42.42 v45.09,42.67
  Top 0.254: v52.58,42.93 52.32,43.18 48.01,43.18 v47.5,42.67
  Bottom 0.254: JP2.5 53.34,48.13 52.32,47.12 52.32,43.18 v52.58,42.93 | v47.5,42.67 v45.09,42.67
IO5  (via drill 0.3)
  Top 0.203: v33.53,20.19 34.04,20.19 34.54,20.7 41.91,20.7 42.29,21.08 44.45,21.08 45.59,22.23 U1.34
  Bottom 0.254: JP3.3 36.58,50.67 33.66,47.75 33.66,45.85 33.02,45.21 33.02,20.7 v33.53,20.19
IO12  (via drill 0.3)
  Top 0.203: U1.18 49.48,29.52 48.9,30.1 48.13,30.1 v47.75,30.48
  Bottom 0.203: v47.75,30.48 47.62,30.48 46.86,31.24 46.86,31.75 46.48,32.13 45.97,32.13 44.07,30.23 44.07,16.38 52.45,8 53.21,8 57.28,3.94 57.91,3.94 58.42,3.43 JP4.3
IO13  (via drill 0.3)
  Top 0.203: U1.20 48.68,28.41 46.74,30.35 46.74,30.86 46.23,31.37 v46.23,31.5
  Bottom 0.203: v46.23,31.5 45.97,31.5 44.45,29.97 44.45,16.64 52.58,8.51 53.34,8.51 57.4,4.45 60.33,4.45 60.96,3.81 JP4.2
IO14  (via drill 0.3)
  Top 0.203: U1.17 49.88,29.75 48.9,30.73 48.39,30.73 v46.23,32.89
  Bottom 0.203: v46.23,32.89 46.1,32.89 44.01,30.8 43.81,30.61 43.69,30.48 43.69,16.13 52.32,7.49 53.09,7.49 55.88,4.7 JP4.4
IO15  (via drill 0.3)
  Top 0.203: U1.21 48.28,28.18 46.1,30.35 v46.1,30.61
  Bottom 0.203: v46.1,30.61 45.72,30.61 44.83,29.72 44.83,16.89 52.7,9.02 53.47,9.02 57.53,4.95 62.23,4.95 63.5,3.68 JP4.1
IO16  (via drill 0.3)
  Top 0.203: v29.59,30.35 30.35,30.35 30.48,30.23 30.73,29.97 43.94,29.97 46.61,27.3 46.61,26.16 U1.25
  Bottom 0.254: JP3.8 23.88,50.16 29.84,44.2 29.84,30.61 v29.59,30.35
IO17  (via drill 0.3)
  Top 0.203: v30.1,29.46 30.23,29.34 40.89,29.34 41.02,29.21 41.78,29.21 v43.05,27.94 | U1.27 44.45,25.02 44.2,25.27 43.26,25.27 v43.05,25.48
  Bottom 0.203: v43.05,27.94 v43.05,25.48
  Bottom 0.254: JP3.7 26.42,49.66 27.81,48.26 27.81,47.24 30.48,44.58 30.48,29.84 v30.1,29.46
IO18  (via drill 0.3)
  Top 0.203: U1.35 45.8,21.82 44.55,20.57 42.55,20.57 42.16,20.19 34.8,20.19 34.04,19.43 33.15,19.43 32.77,19.81 30.86,19.81 v30.48,19.43
  Bottom 0.203: 31.11,24.77 31.11,20.07 v30.48,19.43
  Bottom 0.254: 31.11,24.77 31.11,45.09 30.48,45.72 30.48,48.9 28.96,50.42 JP3.6
IO19  (via drill 0.3)
  Top 0.203: U1.38 47.48,20.04 47.24,19.81 45.34,19.81 45.09,19.56 43.05,19.56 42.67,19.18 35.31,19.18 34.54,18.41 33.02,18.41 32.77,18.16 31.62,18.16 v31.37,17.91
  Bottom 0.254: JP3.5 31.5,45.97 31.75,45.72 31.75,19.43 31.37,19.05 v31.37,17.91
IO21  (via drill 0.3)
  Top 0.203: U1.42 49.08,18.98 48.13,18.03 46.48,18.03 46.1,17.65 44.2,17.65 43.69,17.14 38.35,17.14 36.45,15.24 35.18,15.24 34.42,16 v34.42,17.02
  Bottom 0.254: JP3.2 38.73,50.8 36.83,48.9 36.2,48.9 34.29,46.99 34.29,45.59 33.66,44.96 33.66,21.34 34.42,20.57 v34.42,17.02
IO22  (via drill 0.3)
  Top 0.203: U1.39 47.88,19.81 47.37,19.3 45.59,19.3 45.34,19.05 43.31,19.05 42.93,18.67 35.56,18.67 35.31,18.41 v35.31,18.16
  Bottom 0.254: JP3.1 40.01,49.15 38.1,49.15 37.21,48.26 36.45,48.26 34.92,46.74 34.92,45.34 34.29,44.7 34.29,21.72 35.05,20.95 35.05,18.41 v35.31,18.16
IO23  (via drill 0.3)
  Top 0.203: U1.36 46.19,21.42 44.83,20.07 42.8,20.07 42.42,19.68 35.05,19.68 34.29,18.92 33.53,18.92 33.4,18.92 v32.38,18.92
  Bottom 0.254: v32.38,18.92 32.38,45.72 32.72,46.05 32.72,48.59 34.04,49.91 JP3.4
IO25  (via drill 0.3)
  Top 0.203: U1.14 51.08,29.82 51.69,30.44 v51.69,30.61
  Bottom 0.254: JP2.6 50.8,47.75 51.69,46.86 v51.69,30.61
IO26  (via drill 0.3)
  Top 0.203: U1.15 50.68,29.84 | 50.68,29.84 50.67,29.84 | 50.68,29.84 50.68,30.74 v50.93,30.99
  Bottom 0.254: JP2.7 48.26,49.4 51.05,46.61 51.05,31.11 v50.93,30.99
IO27  (via drill 0.3)
  Top 0.203: U1.16 50.28,29.99 50.04,30.23 v50.04,31.37
  Bottom 0.254: JP2.8 45.72,50.04 47.88,47.88 48.9,47.88 50.42,46.35 50.42,31.75 v50.04,31.37
IO34  (via drill 0.3)
  Top 0.203: U1.10 52.96,25.02 53.95,26.01 53.95,27.08 54.69,27.81 56.77,27.81 57.91,28.96
  Top 0.254: v25.91,44.32 25.91,44.45 35.05,44.45 36.45,43.05 39.62,43.05 40.39,43.81 43.94,43.81 44.2,43.56 44.2,42.04 v44.32,41.91 | v48.51,42.29 48.77,42.55 51.94,42.55 52.58,41.91 55.63,41.91 57.91,39.62 57.91,28.96
  Bottom 0.254: JP7.1 21.34,49.53 25.91,44.96 v25.91,44.32 | v44.32,41.91 48.13,41.91 v48.51,42.29
IO35  (via drill 0.3)
  Top 0.203: U1.11 52.85,25.42 53.59,26.16 53.59,27.38 54.41,28.19 56.52,28.19 57.4,29.08
  Top 0.254: v24.77,44.07 24.77,43.94 25.02,43.69 26.42,43.69 26.54,43.81 34.67,43.81 36.07,42.42 40.01,42.42 40.77,43.18 43.05,43.18 43.69,42.55 43.69,41.27 v43.94,41.02 | v49.15,41.53 49.53,41.91 51.69,41.91 52.32,41.27 55.37,41.27 57.4,39.24 57.4,29.08
  Bottom 0.254: JP7.2 24.77,44.83 v24.77,44.07 | v43.94,41.02 44.45,41.02 44.7,41.27 48.9,41.27 v49.15,41.53
IO36  (via drill 0.3)
  Top 0.152: U1.5 53.87,23.01 54.23,23.37 54.86,23.37 55.42,23.93 C20.1
  Top 0.203: JP4.6 52.58,4.32 52.58,10.29 v52.96,10.67 | v57.15,24.13 57.15,24 57.02,23.88 55.72,23.88 C20.1
  Bottom 0.203: v52.96,10.67 52.32,10.67 45.59,17.4 45.59,24.13 47.37,25.91 51.31,25.91 51.69,25.53 51.69,24.26 52.07,23.88 56.9,23.88 v57.15,24.13
IO39  (via drill 0.3)
  Top 0.152: U1.8 53.2,24.22 53.87,24.89 C21.2 54.57,25.23 54.71,25.38 56.79,25.38 v57.02,25.15
  Top 0.203: JP4.5 53.34,9.65 v53.21,9.78 | v57.02,25.15 57.02,25.27
  Bottom 0.203: v53.21,9.78 52.58,9.78 45.21,17.14 45.21,24.26 47.24,26.29 51.44,26.29 52.07,25.65 52.07,24.51 52.32,24.26 56.39,24.26 57.02,24.89 v57.02,25.15
LNA
  Top 0.152: 53.61,21.86 52.37,21.86 arc45 U1.2
  Top 0.406: C5.2
  Top 0.457: C5.2 L2.2 53.61,21.86
  pour Top (no thermals): 52.65,21.92 53.59,22.07 53.59,21.64 52.65,21.72
N$1
  Top 0.254: D1.C | D1.C R8.1
N$2
  Top 0.203: U1.45 50.28,19.7 50.55,19.43 50.55,17.91 Y1.3 52.48,17.41 C4.1
N$3
  Top 0.203: 49.62,15.89 50.16,16.43 50.16,19.18 49.88,19.47 U1.44 | C3.2 49.19,16.21 Y1.1
  Top 0.254: 49.62,15.89 Y1.1
N$4
  cutout Top: 13.34,40.01 17.14,40.01 17.14,36.2 13.34,36.2
N$5
  Top 0.254: IC2.4 9.35,38.1 arc90 9.22,38 9.22,37.21 arc-90 9.02,37.03 8.64,37.03 arc-90 8.46,37.19 8.46,38 arc90 8.31,38.15 4.72,38.15 JP1.D+1
N$6
  cutout Top: 47.24,25.65 51.31,25.65 51.31,21.59 47.24,21.59
N$7
  Top 0.457: A1.ANT R2.1
N$9  (via drill 0.3)
  Top 0.203: 4.24,38.73 4.34,38.68
  Top 0.254: 9.09,38.68 v9.27,38.86 9.27,38.68 4.34,38.68 | IC2.5 11.08,37.6 10.92,37.44 v9.98,37.44
  Top 0.305: JP1.D-1 4.24,38.73
  Bottom 0.254: v9.98,37.44 10.06,37.44 10.03,37.47 9.53,37.47 9.27,37.72 v9.27,38.86
N$11
  Top 0.152: R1.2 C15.2 51.46,19.66 51.08,20.04 U1.47
N$12
  Top 0.254: D2.C 5.32,26.72 R4.1
N$13
  Top 0.254: R7.2 | R7.2 D6.A
N$16
  Top 0.813: J2.PWR 14.73,7.87 16.89,5.71 D4.A
N$17
  Top 0.152: R1.1 C15.1 53.62,19.66 53.49,19.79 53.49,20.19 53.37,20.32 C16.1 51.78,20.32 U1.48
N$18
  Top 0.406: R3.2 60.88,13.49 A2.P$3
N$20
  Top 0.406: 59.76,21.87 C6.1 | 60.86,21.86 R3.1
  Top 0.457: C5.1 59.76,21.87 | C6.1 60.86,21.86
N$24
  Top 0.152: U1.7 53.42,23.82 53.98,24.38 55.16,24.38 C21.1
N$26
  Top 0.152: U1.6 53.65,23.42 54.15,23.9 C20.2
N$30
  Top 0.152: 52.37,25.82 52.37,26.27
  Top 0.203: U1.12 52.37,25.82 | 54.23,33.25 Y2.P$2 | 52.37,26.27 52.37,26.38 51.94,26.8 51.94,27.91 54.23,30.2 54.23,32.05 C22.2 54.29,33.2 Y2.P$2 | 54.22,33.27 Y2.P$2
N$31
  Top 0.203: U1.13 51.48,28.11 53.34,29.97 53.34,33.91 53.72,34.29 54.2,34.29 Y2.P$1 54.29,34.31 C23.2
RI  (via drill 0.3)
  Top 0.254: v62.23,40.01 62.87,40.01 63.5,40.64 63.5,46.35 62.87,46.99 19.28,46.99 17.14,44.86 v16.89,44.86 | IC2.2 11.23,39.09 10.59,39.73 10.08,39.73 9.78,40.03 9.78,42.16 10.16,42.55 11.02,42.55 12.09,43.61 v12.55,43.61
  Bottom 0.254: JP6.2 66.04,33.02 63.5,35.56 63.5,39.37 62.87,40.01 v62.23,40.01 | v16.89,44.86 16.84,44.91 16.89,44.96 16.89,47.5 16.36,48.03 13.13,48.03 12.7,47.6 12.7,44.2 12.62,44.12 12.62,43.69 v12.55,43.61
RST  (via drill 0.3, 0.5)
  Top 0.152: U1.9 53.07,24.62 54.3,25.86 C7.1 R23.1
  Top 0.203: v47.12,33.15 48.39,31.88 49.53,31.88 49.66,32 50.29,32 50.67,31.62 51.31,31.62 51.56,31.37 51.94,31.37 52.45,30.86 v52.45,30.23 | v58.67,28.96 57.02,27.3 54.86,27.3 54.61,27.05 54.61,26.61 R23.1
  Top 0.254: v22.86,38.1 22.86,42.34 v22.89,42.37 26.03,42.37 Q1.3
  Top 0.305: Q1.3 26.2,42.55 | S1.P$2 8.61,50.16 10.16,50.16 v10.79,49.53
  Bottom 0.203: 37.8,15.85 37.8,17.45 37.47,17.78 37.47,21.21 36.83,21.84 36.83,31.88 37.59,32.64 44.96,32.64 45.85,33.53 46.74,33.53 v47.12,33.15 | v52.45,30.23 52.45,29.08 53.21,28.32 58.04,28.32 v58.67,28.96
  Bottom 0.254: JP5.6 33.02,6.35 29.21,10.16 23.5,10.16 22.86,10.79 22.86,12.19 23.37,12.7 | v10.79,49.53 10.79,49.51 11.61,48.69 16.59,48.69 22.89,42.39 v22.89,42.37 | 23.37,12.7 34.65,12.7 37.8,15.85 | 23.37,12.7 22.86,13.21 v22.86,38.1
RTS  (via drill 0.3)
  Top 0.254: Q1.2 26.04,39.33 v26.04,39.12 | v19.05,39.37 17.78,40.64 17.78,43.38 17.6,43.56 16.38,43.56 16.03,43.2 16.03,42.01 15.74,41.72 IC2.24
  Top 0.305: Q2.1 Q1.2
  Bottom 0.254: v26.04,39.12 25.78,39.37 v19.05,39.37
SD_CLK
  Top 0.203: U2.6 44.2,22.86 44.76,23.42 U1.31
SD_CMD
  Top 0.203: U2.1 37.47,25.4 38.1,24.77 38.1,24.13 38.73,23.5 44.2,23.5 44.52,23.82 U1.30
SD_D0
  Top 0.203: U2.2 36.47,24.13 36.83,23.77 36.83,23.47 38.08,22.23 44.27,22.23 45.07,23.02 U1.32
SD_D1
  Top 0.203: U1.33 45.35,22.62 44.32,21.59 U2.5
SD_D2
  Top 0.203: U2.7 42.16,24.13 42.75,24.71 44.17,24.71 44.26,24.62 U1.28
SD_D3  (via drill 0.3)
  Top 0.203: U2.3 36.2,22.86 37.52,21.54 v38.99,21.54 | U1.29 43.12,24.22 v43.03,24.13
  Bottom 0.203: v38.99,21.54 42.49,21.54 42.93,21.97 42.93,24.03 v43.03,24.13
U0RX  (via drill 0.3)
  Top 0.203: U1.40 48.28,19.57 47.62,18.92 45.85,18.92 45.59,18.67 43.69,18.67 43.18,18.16 36.45,18.16 36.2,17.91 v36.2,16.26 | R4.2 v15.62,28.45
  Top 0.254: 36.83,45.72 19.99,45.72 18.67,44.4 v18.67,41.94 | v62.23,43.81 60.33,45.72 36.83,45.72 | v36.83,45.09 36.83,45.72 | v14.58,42.49 14.74,42.33 IC2.26
  Bottom 0.203: v15.62,28.45 15.11,28.45 13.21,30.35 13.21,33.66 12.06,34.8 12.06,40.01 11.68,40.39 11.68,41.78 12.39,42.49 v14.58,42.49 14.53,42.55
  Bottom 0.254: JP2.1 63.5,45.09 v62.23,43.81 | v36.83,45.09 36.2,45.09 35.87,44.76 35.87,42.98 36.2,42.65 36.2,33.02 35.56,32.38 35.56,21.46 36.2,20.83 v36.2,16.26 | v18.67,41.94 18.62,41.88 14.99,41.88 14.58,42.29 v14.58,42.49
U0TX  (via drill 0.3)
  Top 0.203: U1.41 48.68,19.21 47.88,18.41 46.1,18.41 45.85,18.16 43.94,18.16 43.43,17.65 37.72,17.65 v37.08,17.02 | R8.2 v6.35,24.64 | v14.86,43.94 14.96,43.94 15.47,43.43
  Top 0.254: v62.23,45.72 61.59,46.35 19.61,46.35 17.37,44.12 16.15,44.12 15.47,43.43 15.47,42.22 15.24,41.99 IC2.25 | v38.73,44.45 39.37,45.09 58.98,45.09 60.25,43.81 v60.33,43.81
  Bottom 0.203: v6.35,24.64 6.86,25.15 6.86,34.8 7.37,35.31 7.37,40.64 7.75,41.02 8.64,41.02 9.53,40.13 10.97,40.13 11.23,40.39 11.23,41.96 12.19,42.93 13.84,42.93 v14.86,43.94
  Bottom 0.254: JP2.2 61.59,50.16 61.59,48.9 62.87,47.62 62.87,46.35 v62.23,45.72 v60.33,43.81 | v38.73,44.45 38.1,43.81 38.1,42.55 36.83,41.27 36.83,32.77 36.2,32.13 36.2,21.59 36.83,20.95 36.83,17.27 v37.08,17.02
USBVCC  (via drill 0.5, 0.6)
  Top 0.254: JP1.VBUS1 4.25,39.42
  Top 0.305: IC2.8 13.34,35.2
  Top 0.406: v17.78,24.77 18.54,24.01 D5.2 | C8.2 C13.2 | C13.2 13.32,34.38 13.34,34.92 13.34,35.2 | v8.1,40.23 8.1,39.9 7.62,39.42 4.72,39.42 JP1.VBUS1 | C13.2 12.9,34.11 v12.32,33.53
  Bottom 0.406: v8.1,40.23 8.1,35.71 10.29,33.53 v12.32,33.53 12.32,30.23 v17.78,24.77
VIN  (via drill 0.6, 0.61)
  Top 0.406: v19.68,20.95 20.84,22.11 D5.1
  Top 0.813: IC1.3 19.68,19.53 v19.68,20.95 | v24.13,11.43 23.5,10.79 23.5,10.29 C10.1 21.46,9.02 20.32,10.16 20.32,10.79 v19.68,11.43 18.8,10.54 D4.C
  Bottom 0.813: v24.13,11.43 29.84,11.43 35.56,5.71 43.81,5.71 45.72,3.81 JP5.1 | v19.68,20.95 v19.68,11.43

### Text on the board
tPlace: IO35 | IO34 | IO16 | IO17 | 13 | 12 | 11 | 10 | 9 | 8 | 7 | 6 | 5 | 4 | 3 | 2 | 1 | 0 | RST | SCL | SDA | x | x | SCK | MI | MO | x | TX | RX | [x = Restricted] | DTR | RTS | GND | RI | DCD | DSR | 3V3 | CTS | RX | TX | PWR | noduino.org | RST | 3V3 | 3V3 | GND | GND | VIN | IO36 | IO39 | IO14 | IO12 | IO13 | IO15
bPlace: IO35 | IO34 | IO16/EMAC_CLK_OUT | IO17/EMAC_CLK_OUT_180 | IO18 | IO19/EMAC_TXD0 | IO23 | IO5 | IO21/EMAC_TX_EN | IO22/EMAC_TXD1 | IO27/RIO17/T7/A2C7 | IO26/RIO7/DAC2/A2C9 | IO25/RIO6/DAC1/A2C8 | IO4/RIO10/T0/A2C0 | IO0/RIO11/T1/A2C1 | IO2/RIO12/T2/A2C2 | IO1 | IO3 | AUTHOR: JACK TAN V0.8 | A1C0/RIO0/ADH | A1C3/RIO3/ADH | A2C4/T4/RIO14 | A2C2/T2/RIO12 | A2C3/T3/RIO13 | A2C5/T5/RIO15